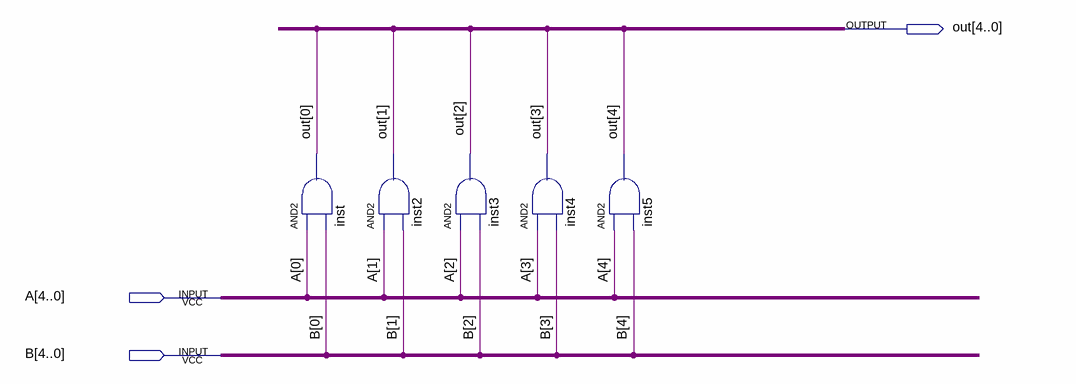
[diagram p0: schematic sheet]
// Quartus schematic CircuitoAND.bdf as structural Verilog: 5 symbols, 3 pins
module CircuitoAND (
  input  [4:0] A,
  input  [4:0] B,
  output [4:0] out
);

  and inst (out[0], A[0], B[0]);
  and inst2 (out[1], A[1], B[1]);
  and inst3 (out[2], A[2], B[2]);
  and inst4 (out[3], A[3], B[3]);
  and inst5 (out[4], A[4], B[4]);
endmodule
